# Altium schematic sheet power_supply.SchDoc: Power Supply
size Letter; Engineer: Nicholas Morrow; DocumentNumber: 4; SheetNumber: 4; SheetTotal: 11; Project: GARY Synthesizer
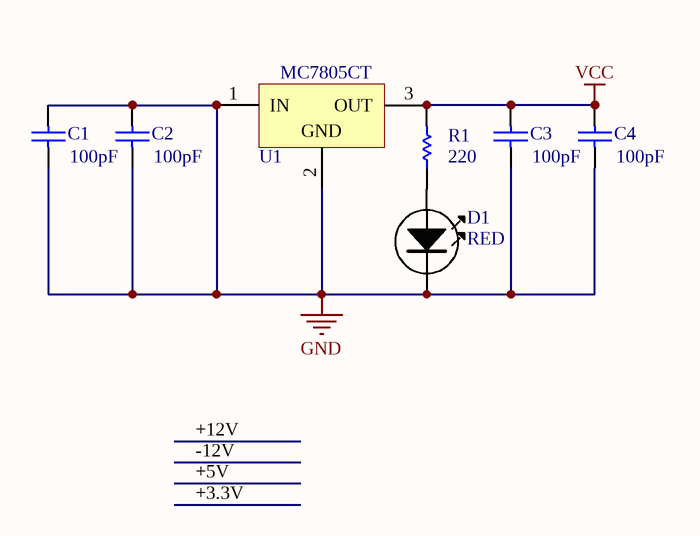
[diagram p0: power_supply.SchDoc]

## Parts
C1  value 100pF  [RAD-0.3]  (hidden comment: Cap)
C2  value 100pF  [RAD-0.3]  (hidden comment: Cap)
C3  value 100pF  [RAD-0.3]  (hidden comment: Cap)
C4  value 100pF  [RAD-0.3]  (hidden comment: Cap)
D1  RED  [LED-5MM-RED]
R1  value 220  [AXIAL-0.3]
U1  MC7805CT  [221A-06]

## Nets
GND: C1.1 C1.2 C2.1 C2.2 C3.1 C4.1 D1.K U1.1(IN) U1.2(GND)
VCC: C3.2 C4.2 R1.2 U1.3(OUT)
NetD1_A: D1.A R1.1

## Notes on the sheet
- Notes:
- Title:
- Size:
- Project:
- Letter
- Number:
- Revision:
- Date:
- Engineer:
- Sheet:
- of

## Library data of the parts
C1-C4 = Cap: Capacitor; Published: 8-Jun-2000; LatestRevisionDate: 17-Jul-2002; LatestRevisionNote: Re-released for DXP Platform.; PackageReference: RAD-0.3; Publisher: Altium Limited; PackageDescription: Radial Cap, Thru-Hole; 2 Leads; 0.3 in Pin Spacing
D1 = LED-RED-5MM
R1 = Res1: Resistor; Published: 8-Jun-2000; LatestRevisionDate: 17-Jul-2002; LatestRevisionNote: Re-released for DXP Platform.; PackageReference: AXIAL-0.3; Publisher: Altium Limited; PackageDescription: Axial Device, Thru-Hole; 2 Leads; 0.3 in Pin Spacing
U1 = MC7805CT: Three-Terminal Positive Voltage Regulator; Note: Heatsink surface is connected to Pin 2; Published: 15-Apr-2002; DatasheetVersion: 1997; PackageVersion: 1997; PackageReference: 221A-06; Publisher: Altium Limited; PackageDescription: TO, Thru-Hole, Vertical, Heatsink Mounted; 3 In-Line Leads; Pitch 2.54 mm; Code_JEDEC: TO-262-AA; ComponentLink1Description: Manufacturer Link; ComponentLink1URL: http://www.onsemi.com/site/products/taxonomy/0,4438,503,00.html; ComponentLink2Description: Datasheet; ComponentLink2URL: http://www.onsemi.com/pub/Collateral/MC7800-D.PDF